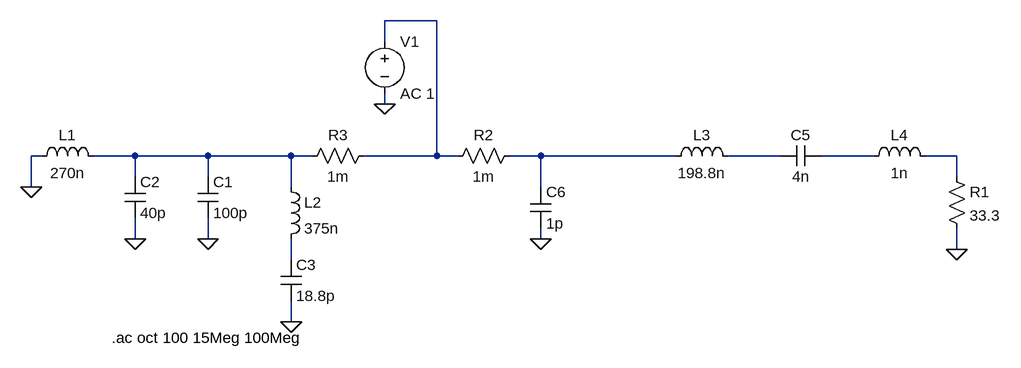
[diagram p0: schematic Draft1.asc]
Draft1.asc, the LTspice schematic file:
Version 4
SHEET 1 1132 680
WIRE 256 -128 176 -128
WIRE 176 -96 176 -128
WIRE 176 0 176 -16
WIRE -352 80 -368 80
WIRE -208 80 -272 80
WIRE -96 80 -208 80
WIRE 32 80 -96 80
WIRE 64 80 32 80
WIRE 256 80 256 -128
WIRE 256 80 144 80
WIRE 288 80 256 80
WIRE 416 80 368 80
WIRE 624 80 416 80
WIRE 784 80 704 80
WIRE 928 80 848 80
WIRE 1056 80 1008 80
WIRE -208 112 -208 80
WIRE -96 112 -96 80
WIRE 1056 112 1056 80
WIRE -368 128 -368 80
WIRE 32 128 32 80
WIRE 416 128 416 80
WIRE -208 208 -208 176
WIRE -96 208 -96 176
WIRE 416 208 416 192
WIRE 1056 224 1056 192
WIRE 32 240 32 208
WIRE 32 336 32 304
FLAG 1056 224 0
FLAG 32 336 0
FLAG -96 208 0
FLAG -208 208 0
FLAG -368 128 0
FLAG 176 0 0
FLAG 416 208 0
SYMBOL cap -112 112 R0
SYMATTR InstName C1
SYMATTR Value 100p
SYMBOL cap -224 112 R0
SYMATTR InstName C2
SYMATTR Value 40p
SYMBOL cap 16 240 R0
SYMATTR InstName C3
SYMATTR Value 18.8p
SYMBOL cap 848 64 R90
WINDOW 0 0 32 VBottom 2
WINDOW 3 32 32 VTop 2
SYMATTR InstName C5
SYMATTR Value 4n
SYMBOL ind -368 96 R270
WINDOW 0 32 56 VTop 2
WINDOW 3 5 56 VBottom 2
SYMATTR InstName L1
SYMATTR Value 270n
SYMBOL ind 16 112 R0
SYMATTR InstName L2
SYMATTR Value 375n
SYMBOL ind 608 96 R270
WINDOW 0 32 56 VTop 2
WINDOW 3 5 56 VBottom 2
SYMATTR InstName L3
SYMATTR Value 198.8n
SYMBOL ind 912 96 R270
WINDOW 0 32 56 VTop 2
WINDOW 3 5 56 VBottom 2
SYMATTR InstName L4
SYMATTR Value 1n
SYMBOL res 1040 96 R0
SYMATTR InstName R1
SYMATTR Value 33.3
SYMBOL voltage 176 -112 R0
WINDOW 123 0 0 Left 2
WINDOW 39 0 0 Left 2
SYMATTR InstName V1
SYMATTR Value AC 1
SYMBOL cap 400 128 R0
SYMATTR InstName C6
SYMATTR Value 1p
SYMBOL res 384 64 R90
WINDOW 0 0 56 VBottom 2
WINDOW 3 32 56 VTop 2
SYMATTR InstName R2
SYMATTR Value 1m
SYMBOL res 48 96 R270
WINDOW 0 32 56 VTop 2
WINDOW 3 0 56 VBottom 2
SYMATTR InstName R3
SYMATTR Value 1m
TEXT -244 360 Left 2 !.ac oct 100 15Meg 100Meg

The netlist it stands for:
* Draft1.asc
C1 N002 0 100p
C2 N002 0 40p
C3 N007 0 18.8p
C5 N005 N004 4n
L1 0 N002 270n
L2 N002 N007 375n
L3 N003 N004 198.8n
L4 N005 N006 1n
R1 N006 0 33.3
V1 N001 0 AC 1
C6 N003 0 1p
R2 N003 N001 1m
R3 N002 N001 1m
.ac oct 100 15Meg 100Meg
.backanno
.end